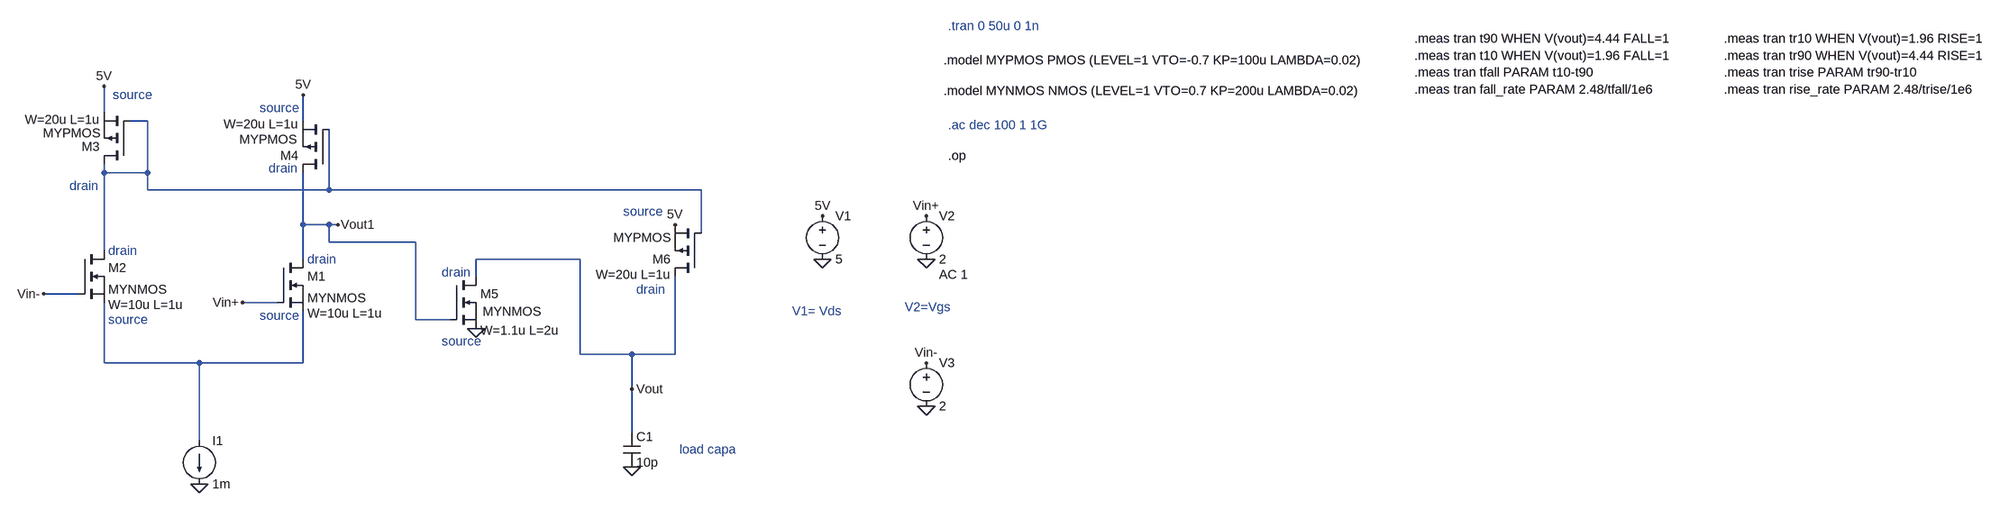
[diagram p0: schematic two_stage_opamp.asc]
two_stage_opamp.asc, the LTspice schematic file:
Version 4.1
SHEET 1 3252 680
WIRE -1088 -208 -1088 -256
WIRE -1008 -192 -1040 -192
WIRE -720 -192 -720 -240
WIRE -1088 -96 -1088 -112
WIRE -1008 -96 -1008 -192
WIRE -1008 -96 -1088 -96
WIRE -1008 -64 -1008 -96
WIRE -672 -64 -672 -176
WIRE -672 -64 -1008 -64
WIRE 16 -64 -672 -64
WIRE -720 0 -720 -96
WIRE -672 0 -720 0
WIRE -656 0 -672 0
WIRE 16 16 16 -64
WIRE -672 32 -672 0
WIRE -512 32 -672 32
WIRE -1088 48 -1088 -96
WIRE -720 64 -720 0
WIRE -208 64 -400 64
WIRE -400 96 -400 64
WIRE -1136 128 -1200 128
WIRE -768 144 -832 144
WIRE -512 176 -512 32
WIRE -448 176 -512 176
WIRE -208 240 -208 64
WIRE -112 240 -208 240
WIRE -32 240 -32 96
WIRE -32 240 -112 240
WIRE -1088 256 -1088 144
WIRE -912 256 -1088 256
WIRE -720 256 -720 160
WIRE -720 256 -912 256
WIRE -112 304 -112 240
WIRE -112 384 -112 304
WIRE -912 400 -912 256
FLAG 864 64 0
FLAG 864 -16 5V
FLAG -832 144 Vin+
FLAG 1056 64 0
FLAG 1056 -16 Vin+
FLAG -1200 128 Vin-
FLAG 1056 336 0
FLAG 1056 256 Vin-
FLAG -912 480 0
FLAG -720 -240 5V
FLAG -1088 -256 5V
FLAG -656 0 Vout1
FLAG -32 0 5V
FLAG -400 192 0
FLAG -112 304 Vout
FLAG -112 448 0
SYMBOL nmos -768 64 R0
WINDOW 39 56 100 Left 2
SYMATTR InstName M1
SYMATTR Value MYNMOS
SYMATTR SpiceLine W=10u L=1u
SYMBOL voltage 864 -32 R0
WINDOW 123 0 0 Left 0
WINDOW 39 0 0 Left 0
SYMATTR InstName V1
SYMATTR Value 5
SYMBOL voltage 1056 -32 R0
WINDOW 123 24 124 Left 2
WINDOW 39 0 0 Left 0
SYMATTR InstName V2
SYMATTR Value 2
SYMATTR Value2 AC 1
SYMBOL nmos -1136 48 R0
WINDOW 39 56 100 Left 2
SYMATTR InstName M2
SYMATTR Value MYNMOS
SYMATTR SpiceLine W=10u L=1u
SYMBOL voltage 1056 240 R0
WINDOW 123 0 0 Left 0
WINDOW 39 0 0 Left 0
SYMATTR InstName V3
SYMATTR Value 2
SYMBOL current -912 400 R0
WINDOW 123 0 0 Left 0
WINDOW 39 0 0 Left 0
SYMATTR InstName I1
SYMATTR Value 1m
SYMBOL pmos -1040 -112 R180
WINDOW 3 55 57 Left 2
WINDOW 39 56 82 Left 2
SYMATTR InstName M3
SYMATTR Value MYPMOS
SYMATTR SpiceLine W=20u L=1u
SYMBOL pmos -672 -96 R180
WINDOW 3 59 62 Left 2
WINDOW 39 56 90 Left 2
SYMATTR InstName M4
SYMATTR Value MYPMOS
SYMATTR SpiceLine W=20u L=1u
SYMBOL nmos -448 96 R0
WINDOW 3 60 65 Left 2
WINDOW 39 56 100 Left 2
SYMATTR InstName M5
SYMATTR Value MYNMOS
SYMATTR SpiceLine W=1.1u L=2u
SYMBOL pmos 16 96 R180
WINDOW 39 56 4 Left 2
SYMATTR InstName M6
SYMATTR Value MYPMOS
SYMATTR SpiceLine W=20u L=1u
SYMBOL cap -128 384 R0
SYMATTR InstName C1
SYMATTR Value 10p
TEXT 1088 -248 Left 2 !.model MYNMOS NMOS (LEVEL=1 VTO=0.7 KP=200u LAMBDA=0.02)
TEXT 808 160 Left 2 ;V1= Vds
TEXT 1016 152 Left 2 ;V2=Vgs
TEXT 1088 -304 Left 2 !.model MYPMOS PMOS (LEVEL=1 VTO=-0.7 KP=100u LAMBDA=0.02)
TEXT -1152 -72 Left 2 ;drain
TEXT -1072 -240 Left 2 ;source
TEXT -1080 48 Left 2 ;drain
TEXT -1080 176 Left 2 ;source
TEXT -712 64 Left 2 ;drain
TEXT -784 -104 Left 2 ;drain
TEXT -800 -216 Left 2 ;source
TEXT -800 168 Left 2 ;source
TEXT -464 88 Left 2 ;drain
TEXT -464 216 Left 2 ;source
TEXT -128 -24 Left 2 ;source
TEXT -104 120 Left 2 ;drain
TEXT 1096 -184 Left 2 ;.ac dec 100 1 1G
TEXT -24 416 Left 2 ;load capa
TEXT 1096 -368 Left 2 ;.tran 0 50u 0 1n
TEXT 2104 -344 Left 2 !.meas tran t90 WHEN V(vout)=4.44 FALL=1\n.meas tran t10 WHEN V(vout)=1.96 FALL=1\n.meas tran tfall PARAM t10-t90\n.meas tran fall_rate PARAM 2.48/tfall/1e6
TEXT 2728 -344 Left 2 !.meas tran tr10 WHEN V(vout)=1.96 RISE=1\n.meas tran tr90 WHEN V(vout)=4.44 RISE=1\n.meas tran trise PARAM tr90-tr10\n.meas tran rise_rate PARAM 2.48/trise/1e6
TEXT 1096 -128 Left 2 !.op

The netlist it stands for:
* two_stage_opamp.asc
M1 Vout1 Vin+ N002 N002 MYNMOS W=10u L=1u
V1 5V 0 5
V2 Vin+ 0 2 AC 1
M2 N001 Vin- N002 N002 MYNMOS W=10u L=1u
V3 Vin- 0 2
I1 N002 0 1m
M3 N001 N001 5V 5V MYPMOS W=20u L=1u
M4 Vout1 N001 5V 5V MYPMOS W=20u L=1u
M5 Vout Vout1 0 0 MYNMOS W=1.1u L=2u
M6 Vout N001 5V 5V MYPMOS W=20u L=1u
C1 Vout 0 10p
.model NMOS NMOS
.model PMOS PMOS
.lib standard.mos
.model MYNMOS NMOS (LEVEL=1 VTO=0.7 KP=200u LAMBDA=0.02)
* V1= Vds
* V2=Vgs
.model MYPMOS PMOS (LEVEL=1 VTO=-0.7 KP=100u LAMBDA=0.02)
* drain
* source
* drain
* source
* drain
* drain
* source
* source
* drain
* source
* source
* drain
* .ac dec 100 1 1G
* load capa
* .tran 0 50u 0 1n
.meas tran t90 WHEN V(vout)=4.44 FALL=1
.meas tran t10 WHEN V(vout)=1.96 FALL=1
.meas tran tfall PARAM t10-t90
.meas tran fall_rate PARAM 2.48/tfall/1e6
.meas tran tr10 WHEN V(vout)=1.96 RISE=1
.meas tran tr90 WHEN V(vout)=4.44 RISE=1
.meas tran trise PARAM tr90-tr10
.meas tran rise_rate PARAM 2.48/trise/1e6
.op
.backanno
.end